# EAGLE design IO4-SignalDriver (EAGLE 7.7.0)
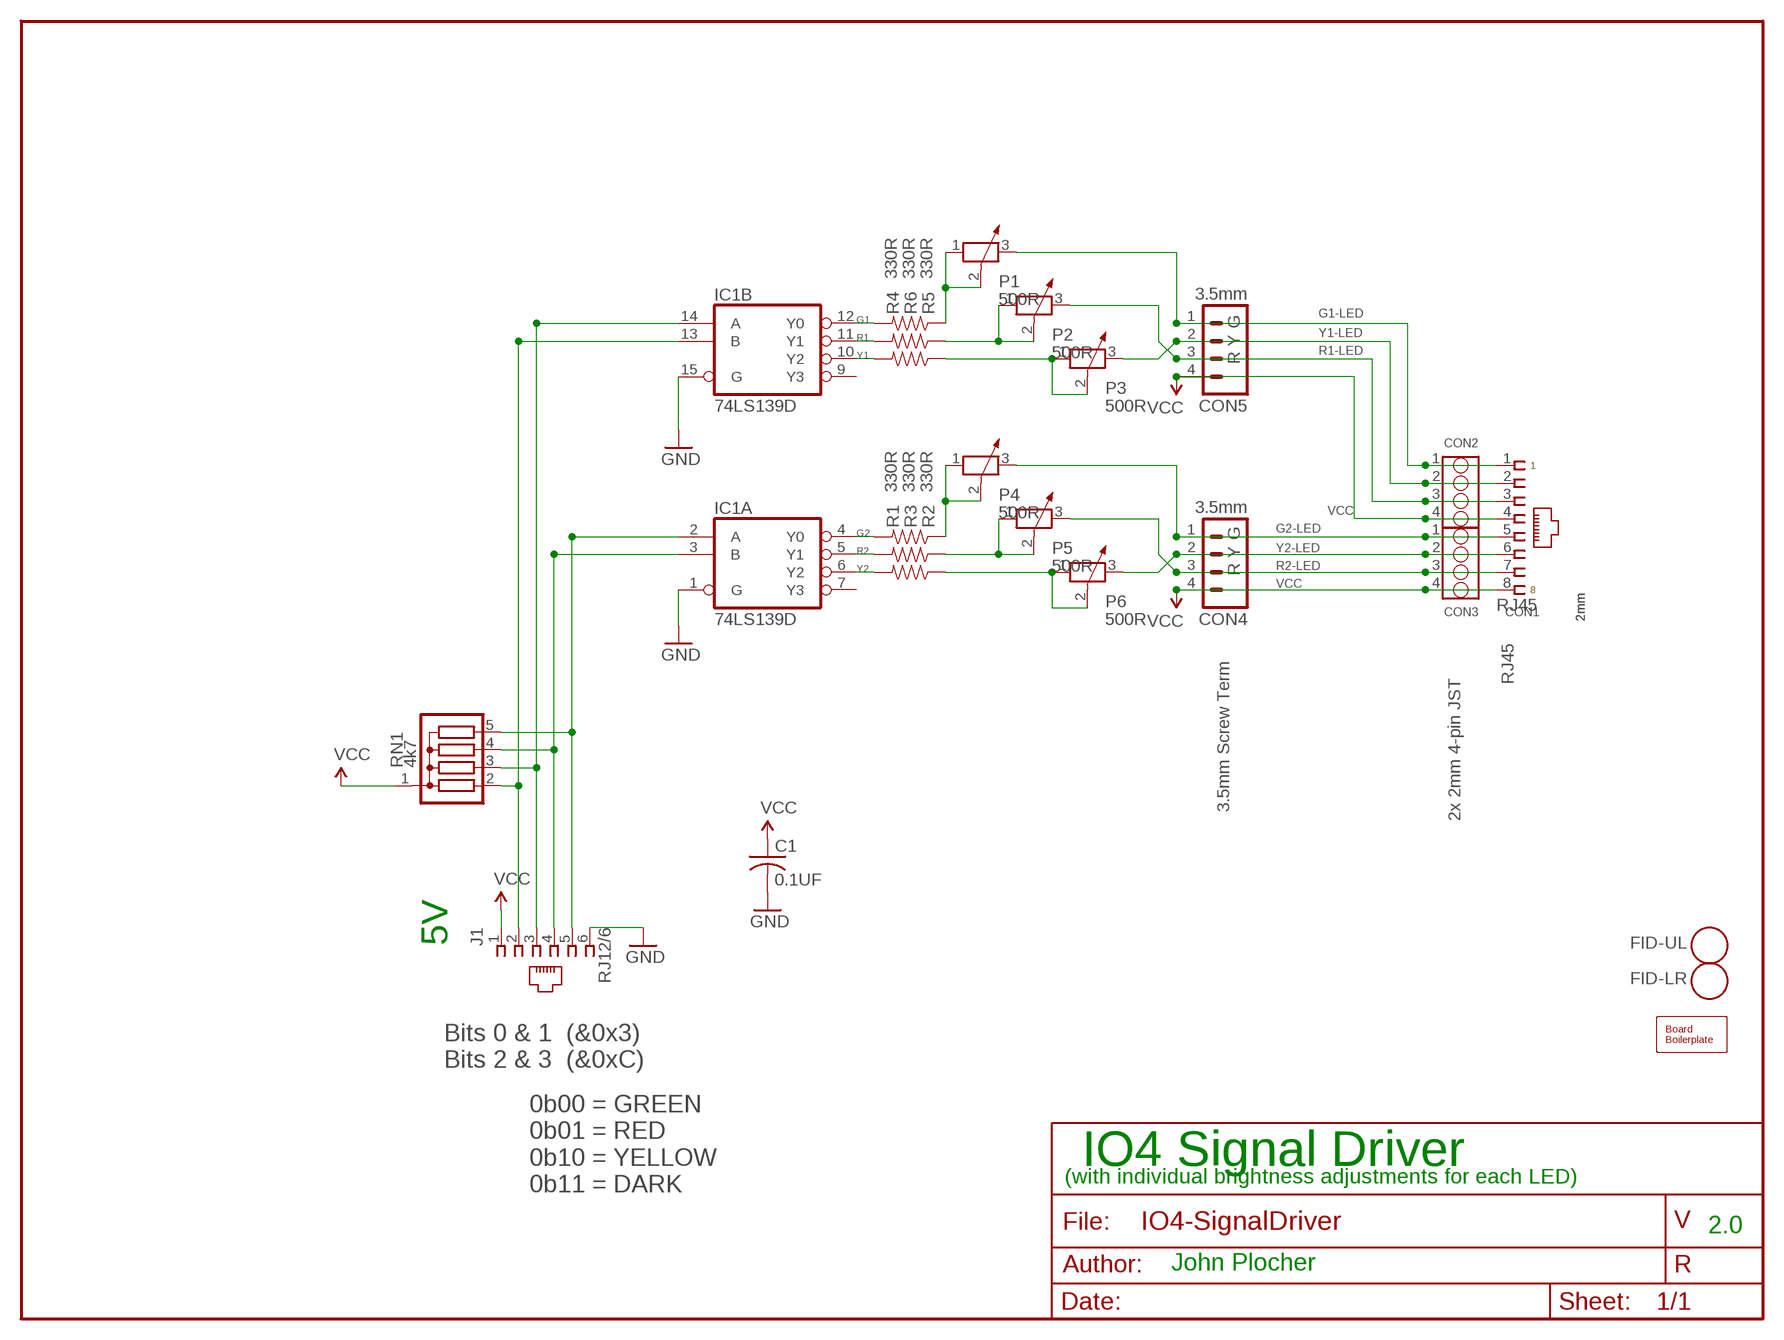
[diagram p0: schematic, sheet 1]

## Parts
BOARD1  BOARD  BOARD80X100  [BOARD-DINRAIL-3.17INX10CM]
C1  0.1UF  CAP0603  [0603-CAP]
CON1  RJ45  CONNECTOR-RJ45-FRONT  [RJ45-NO-SHIELD]
CON2  2mm  CONNECTOR-GROVE-4P-2.0-3470130P1  [4P-2.0]
CON3  2mm  CONNECTOR-GROVE-4P-2.0-3470130P1  [4P-2.0]
CON4  3.5mm  M04SCREW_LOCK  [SCREWTERMINAL-3.5MM-4_LOCK]
CON5  3.5mm  M04SCREW_LOCK  [SCREWTERMINAL-3.5MM-4_LOCK]
FID-LR  FIDUCIAL  [FIDUCIAL_1MM]
FID-UL  FIDUCIAL  [FIDUCIAL_1MM]
IC1  74LS139D  [SO16]
J1  RJ12/6  CONNECTOR-RJ25-6P6C  [RJ25-PANEL]
P1  500R  R-POTENTIOMETERP-3319  [P-3319]
P2  500R  R-POTENTIOMETERP-3319  [P-3319]
P3  500R  R-POTENTIOMETERP-3319  [P-3319]
P4  500R  R-POTENTIOMETERP-3319  [P-3319]
P5  500R  R-POTENTIOMETERP-3319  [P-3319]
P6  500R  R-POTENTIOMETERP-3319  [P-3319]
R1  330R  R0805-RES  [0805-RES]
R2  330R  R0805-RES  [0805-RES]
R3  330R  R0805-RES  [0805-RES]
R4  330R  R0805-RES  [0805-RES]
R5  330R  R0805-RES  [0805-RES]
R6  330R  R0805-RES  [0805-RES]
RN1  4k7  G04R  [SIL5]

## Nets
G1: IC1.12(B:Y0) R4.2
G1-LED: CON1.1 CON2.1 CON5.1 P1.3
G1V: P1.1 P1.2 R4.1
G2: IC1.4(A:Y0) R1.2
G2-LED: CON1.5 CON3.1 CON4.1 P4.3
G2V: P4.1 P4.2 R1.1
GND [power]: C1.2 IC1.1(A:G) IC1.15(B:G) J1.6
N$5: IC1.2(A:A) J1.5 RN1.5
N$6: IC1.3(A:B) J1.4 RN1.4
N$7: IC1.14(B:A) J1.3 RN1.3
N$8: IC1.13(B:B) J1.2 RN1.2
R1: IC1.11(B:Y1) R6.2
R1-LED: CON1.3 CON2.3 CON5.3 P2.3
R1V: P2.1 P2.2 R6.1
R2: IC1.5(A:Y1) R3.2
R2-LED: CON1.7 CON3.3 CON4.3 P5.3
R2V: P5.1 P5.2 R3.1
VCC [power]: C1.1 CON1.4 CON1.8 CON2.4 CON3.4 CON4.4 CON5.4 J1.1 RN1.1
Y1: IC1.10(B:Y2) R5.2
Y1-LED: CON1.2 CON2.2 CON5.2 P3.3
Y1V: P3.1 P3.2 R5.1
Y2: IC1.6(A:Y2) R2.2
Y2-LED: CON1.6 CON3.2 CON4.2 P6.3
Y2V: P6.1 P6.2 R2.1
Unconnected: IC1.7(A:Y3) IC1.9(B:Y3)

## Notes on the sheet
- G
- Y
- R
- G
- Y
- R
- RJ45
- 3.5mm Screw Term
- 2x 2mm 4-pin JST
- 5V
- Bits 0 & 1  (&0x3)
  Bits 2 & 3  (&0xC)
- IO4 Signal Driver
- (with individual brightness adjustments for each LED)
- 0b00 = GREEN
  0b01 = RED
  0b10 = YELLOW
  0b11 = DARK
- 2.0
- John Plocher

## Power pins joined to a net without a drawn wire
GND: IC1.8(P:GND)
VCC: IC1.16(P:VCC)

## Library data of the parts
BOARD1 = SPCoast:BOARD
C1 = SPCoast:CAP*
CON1 = SPCoast:CONNECTOR-RJ45: Tyco CORCOM Modular RJ Jacks No Shield; AMP: 520151-4; OPL: none
CON2 CON3 = SPCoast:CONNECTOR-GROVE-4P-2.0
CON4 CON5 = SparkFun:M04: Header 4 Standard 4-pin 0.1" header. Use with straight break away headers (SKU : PRT-00116), right angle break away headers (PRT-00553), swiss pins (PRT-00743), machine pins (PRT-00117), and female headers (PRT-00115). Molex polarized connector foot print use with SKU : PRT-08231 with associated crimp pins and housings. 1MM SMD Version SKU: PRT-10208
FID-LR FID-UL = SPCoast:FIDUCIAL: For use by pick and place machines to calibrate the vision/machine, 1mm By microbuilder.eu
IC1 = SPCoast:74*139: Dual 2-line to 4-line DECODER/DEMULTIPLEXER
J1 = SPCoast:CONNECTOR-RJ25: AMP connector; AMP: 520250-3; OPL: none
P1-P6 = SPCoast:R-POTENTIOMETER: Potentiometer
R1-R6 = SPCoast:R*: Resistor Basic schematic elements and footprints for 0603, 1206, and PTH 1/10th watt (small) resistors.
RN1 = resistor-sil:G04R: SIL RESISTOR; OC_FARNELL: unknown; OC_NEWARK: unknown

## Net classes
0 default: width 0.305 mm
1 power: width 0.406 mm

## Board
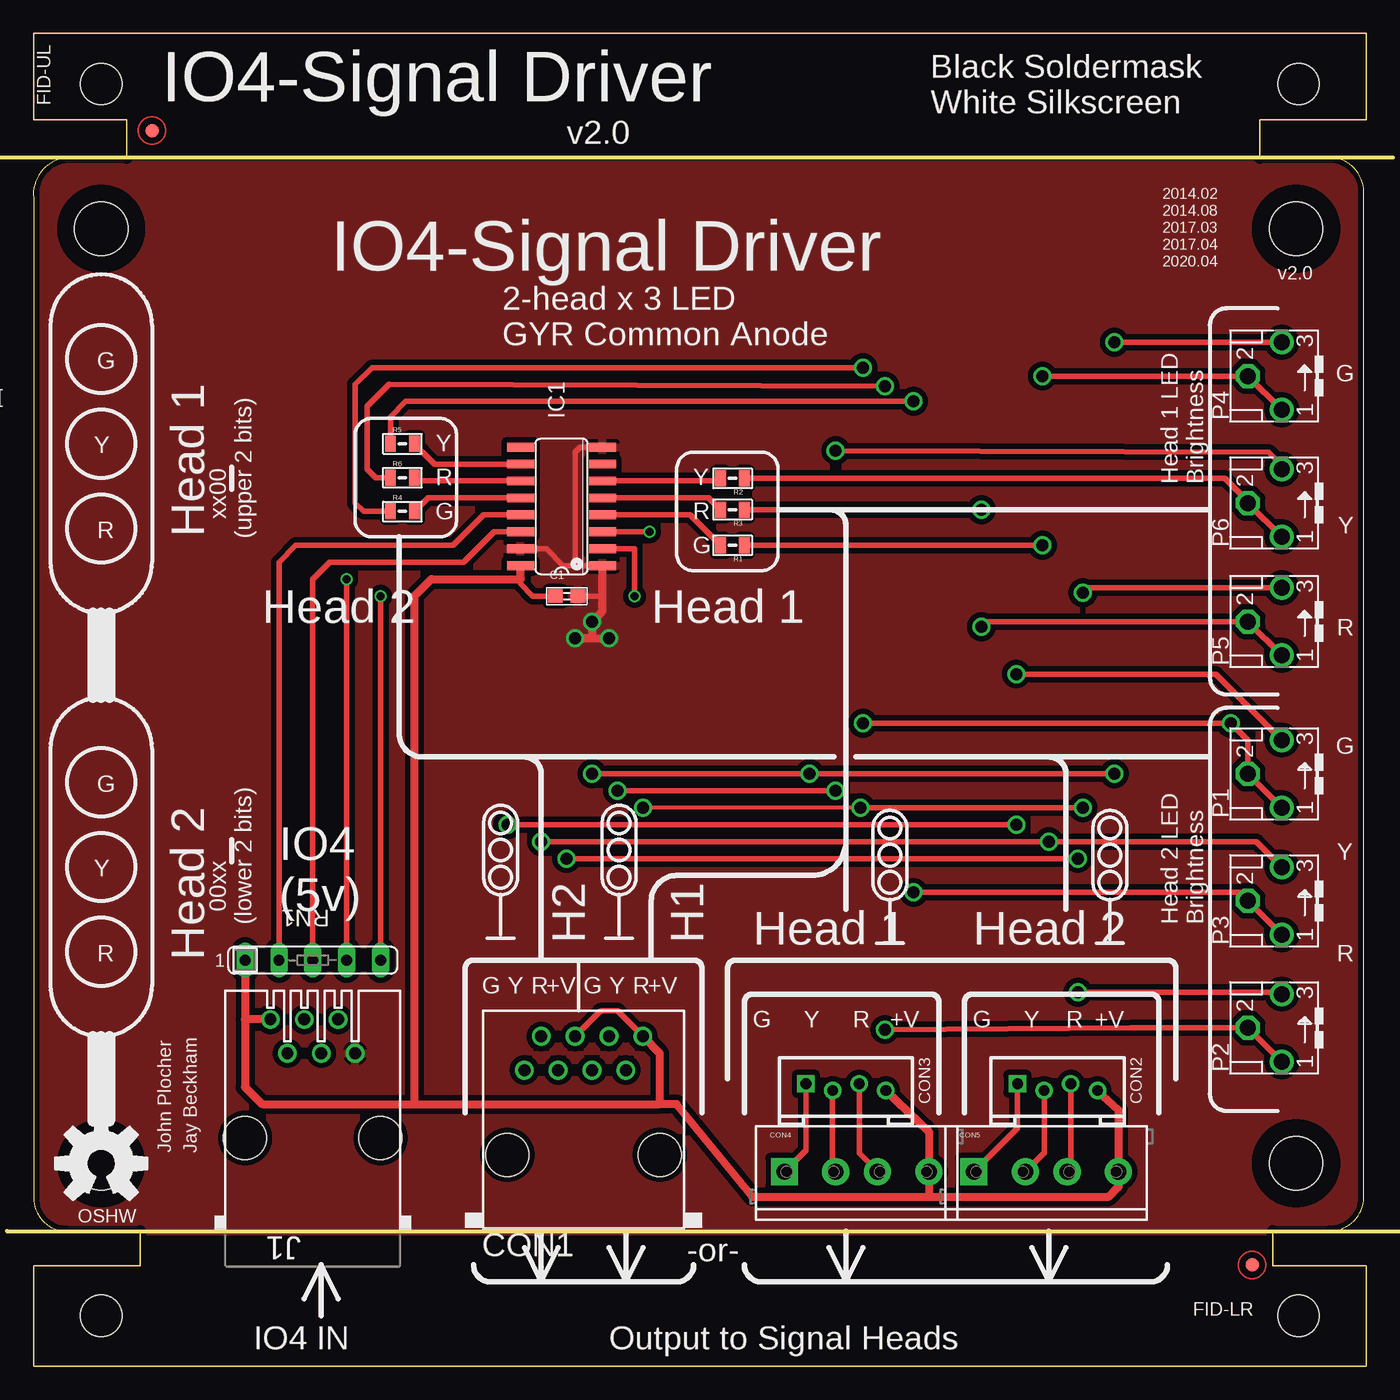
[diagram p1: board, top side]
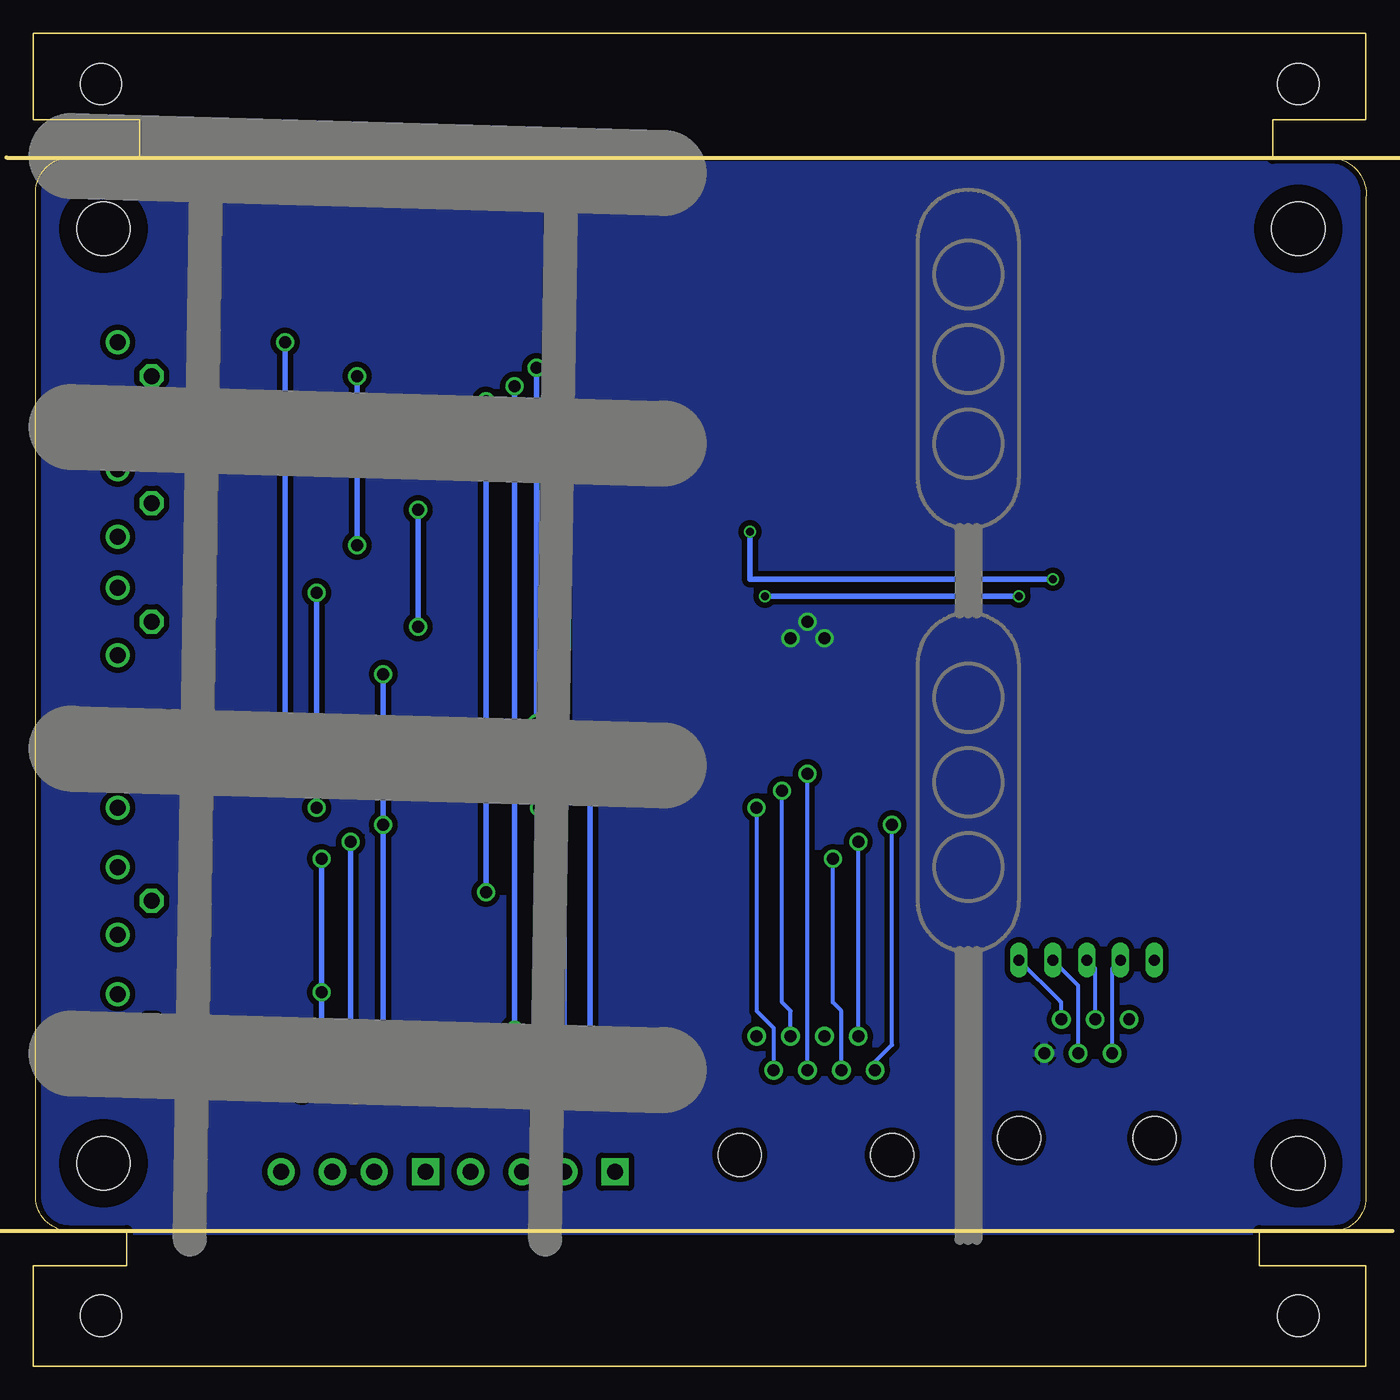
[diagram p2: board, bottom side, seen from below]

Size 100.01 x 100 mm. Coordinates in mm from the lower left corner, seen from the top.
Copper layers (1*16): Top 0.035mm / dielectric 1.5mm / Bottom 0.035mm
Design rules "Seeed_Fusion_eagle_rule_v1.1": minimum track width 6mil, minimum drill 12mil, track to track 6mil, track to pad 6mil, pad to pad 6mil, via to via 6mil, smd to smd 0mil, copper to edge 10mil, drill to drill 10mil, minimum pad ring 10mil, minimum via ring 6mil, stop-mask expansion 2mil, vias tented up to drill 100mil, thermal gap 10mil

### Footprints (pad centres in the part's own frame; a part is rotated, then mirrored left to right if it is on the bottom)
BOARD-DINRAIL-3.17INX10CM = hole 4: 94.742,15.24; 5.08,85.344; 94.742,85.344; 5.08,15.24 | hole 3.1: 5.08,96.19; 94.92,96.19; 5.08,3.81; 94.92,3.81
0603-CAP = smd 1.1 x 1: 1 -0.85,0; 2 0.85,0
RJ45-NO-SHIELD = drill 0.9 pad 1.4: 1 -4.445,6.35; 2 -3.175,8.89; 3 -1.905,6.35; 4 -0.635,8.89; 5 0.635,6.35; 6 1.905,8.89; 7 3.175,6.35; 8 4.445,8.89 | hole 3.251: -5.715,0; 5.715,0
4P-2.0 = drill 0.8 pad 1.27 square: 1 -3,0.254 | drill 0.8 pad 1.27: 2 -1,-0.254; 3 1,0.254; 4 3,-0.254
SCREWTERMINAL-3.5MM-4_LOCK = drill 1.2 pad 2.032 square: 1 -0.178,0 | drill 1.2 pad 2.032: 2 3.678,0; 3 6.822,0; 4 10.678,0
FIDUCIAL_1MM = smd 1 x 1: 1 0,0
SO16 = smd 0.66 x 2.032: 1 -4.445,-3.073; 2 -3.175,-3.073; 3 -1.905,-3.073; 4 -0.635,-3.073; 5 0.635,-3.073; 6 1.905,-3.073; 7 3.175,-3.073; 8 4.445,-3.073; 9 4.445,3.073; 10 3.175,3.073; 11 1.905,3.073; 12 0.635,3.073; 13 -0.635,3.073; 14 -1.905,3.073; 15 -3.175,3.073; 16 -4.445,3.073
RJ25-PANEL = drill 0.889: 1 -3.175,8.89; 2 -1.905,6.35; 3 -0.635,8.89; 4 0.635,6.35; 5 1.905,8.89; 6 3.175,6.35 | hole 3.251: -5.08,0; 5.08,0
P-3319 = drill 1.2: 1 -2.54,-0.318; 3 2.54,-0.318 | drill 1.2 octagon: 2 0,2.223
0805-RES = smd 0.8 x 1.2: 1 -0.9,0; 2 0.9,0
SIL5 = drill 0.813 long: 1 -5.08,0; 2 -2.54,0; 3 0,0; 4 2.54,0; 5 5.08,0

### Placement (x,y rotation side)
BOARD1  0.01,0 0 top
C1  40.02,57.78 0 top
CON1  41.29,15.88 0 top
CON2  76.85,20.95 0 top
CON3  60.97,20.95 0 top
CON4  56.53,14.61 0 top
CON5  70.75,14.61 0 top
FID-LR  91.45,7.62 0 top
FID-UL  8.9,92.71 0 top
IC1  39.64,64.52 90 top
J1  20.97,17.14 0 top
P1  93.36,44.45 90 top
P2  93.36,25.4 90 top
P3  93.36,34.92 90 top
P4  93.36,74.3 90 top
P5  93.36,55.88 90 top
P6  93.36,64.77 90 top
R1  52.46,61.59 180 top
R2  52.46,66.61 180 top
R3  52.46,64.26 180 top
R4  27.7,64.14 0 top
R5  27.7,69.22 0 top
R6  27.7,66.67 0 top
RN1  20.97,30.48 0 top
U$2  OSHW  [OSHW-LOGO-L]  5.09,15.24 0 top

### Tracks (layer width: path | path; a pad name or v marks a point on that pad's centre or on a via)
G1
  Top 0.406: IC1.12 29.62,65.15 R4.2
G1-LED  (via drill 0.9)
  Top 0.406: v35.57,40.64 v73.75,40.64 | CON5.1 73.85,17.88 CON2.1 | v73.75,51.94 88.72,51.94 P1.3
  Bottom 0.305: CON1.1 36.84,22.86 35.57,24.13 v35.57,40.64
  Bottom 0.406: CON2.1 73.75,21.18 v73.75,40.64 v73.75,51.94
G1V  (via drill 0.9)
  Top 0.406: R4.1 24.78,64.14 24.14,64.77 24.14,73.66 25.41,74.93 v62.24,74.93 | v62.24,48.26 v89.87,48.26 91.14,46.99 P1.2 P1.1
  Bottom 0.406: v62.24,48.26 v62.24,74.93
G2
  Top 0.406: IC1.4 49.28,63.88 R1.2
G2-LED  (via drill 0.9)
  Top 0.406: v41.92,44.45 v58.26,44.45 v81.12,44.45 | CON4.1 57.97,16.23 CON3.1 | v81.12,76.83 P4.3
  Bottom 0.305: CON1.5 v41.92,44.45
  Bottom 0.406: CON3.1 58.26,21.36 v58.26,44.45 | v81.12,44.45 v81.12,76.83
G2V  (via drill 0.9)
  Top 0.406: R1.1 v75.71,61.59 | v75.71,74.3 P4.2 P4.1
  Bottom 0.406: v75.71,61.59 v75.71,74.3
GND  (via drill 0.9)
  Top 0.406: C1.2 42.69,57.78 42.69,60.05 IC1.1 40.65,60.07 | IC1.15 38.49,61.34 39.76,60.07 40.65,60.07 | IC1.8 41.03,68.96 40.65,68.58 40.65,60.07
  Top 0.61: IC1.1 42.71,56.67 v41.92,55.88 41.92,54.61 v40.65,54.61 v43.19,54.61
  pour Bottom (isolate 0.406): 0.01,10.16 100.01,10.16 100.01,90.16 0.01,90.16
  pour Top (isolate 0.406): 0.01,10.16 100.01,10.16 100.01,90.16 0.01,90.16
N$5  (via drill 0.6)
  Top 0.406: RN1.5 v26.05,57.78 | v45.1,57.78 45.1,61.34 IC1.2
  Bottom 0.305: J1.5 22.87,27.2 arc-45 22.95,27.38 RN1.5
  Bottom 0.406: v26.05,57.78 v45.1,57.78
N$6  (via drill 0.6)
  Top 0.406: RN1.4 v23.51,59.05 | v46.24,62.61 IC1.3
  Bottom 0.305: J1.4 21.6,28.47 arc-45 21.68,28.65 RN1.4
  Bottom 0.406: v23.51,59.05 46.24,59.05 v46.24,62.61
N$7
  Top 0.406: RN1.3 20.97,59.05 22.24,60.33 32.27,60.33 34.56,62.61 IC1.14
  Bottom 0.305: J1.3 20.33,29.74 arc-45 20.41,29.92 RN1.3
N$8
  Top 0.406: RN1.2 18.43,60.33 19.7,61.59 31.51,61.59 33.8,63.88 IC1.13
  Bottom 0.305: J1.2 19.06,29.74 arc45 18.99,29.92 RN1.2
R1
  Top 0.406: IC1.11 28.85,66.42 R6.2
R1-LED  (via drill 0.9)
  Top 0.406: v40.02,38.1 v78.37,38.1 | CON5.3 77.85,14.88 CON2.3 | v78.37,28.07 93.55,28.07 P2.3
  Bottom 0.305: CON1.3 39.38,26.67 40.02,27.3 v40.02,38.1
  Bottom 0.406: CON2.3 78.37,21.61 v78.37,28.07 v78.37,38.1
R1V  (via drill 0.9)
  Top 0.406: R6.1 25.67,66.67 25.03,67.31 25.03,72.01 26.68,73.66 v63.89,73.53 | v63.89,25.27 82.37,25.4 P2.2 P2.1
  Bottom 0.406: v63.89,25.27 v63.89,73.53
R2
  Top 0.406: IC1.5 50.68,65.15 R3.2
R2-LED  (via drill 0.9)
  Top 0.305: v62.08,41.91 v45.73,41.91
  Top 0.406: CON4.3 61.97,15.98 CON3.3 | v62.08,41.91 v78.75,41.91 | v78.75,58.04 79.13,58.42 P5.3
  Bottom 0.305: v45.73,41.91 45.73,26.67 44.46,25.4 CON1.7
  Bottom 0.406: CON3.3 62.08,21.19 v62.08,41.91 | v78.75,58.04 v78.75,41.91
R2V  (via drill 0.9)
  Top 0.406: R3.1 v71.13,64.26 | v71.13,55.5 71.51,55.88 P5.2 P5.1
  Bottom 0.406: v71.13,64.26 v71.13,55.5
VCC
  Top 0.406: CON1.4 42.48,26.6 arc-45 42.66,26.67 43.83,26.67 CON1.8 | IC1.16 36.56,58.7 37.48,57.78 C1.1
  Top 0.61: CON1.8 47,23.5 47,19.68 | 67.32,12.7 80.66,12.7 81.36,13.4 arc45 81.43,13.58 CON5.4 81.43,19.25 CON2.4 | 67.32,12.7 54.09,12.7 arc-45 53.91,12.77 48.27,19.68 47,19.68 | 67.32,12.7 67.28,12.74 arc-45 67.21,12.92 CON4.4 67.21,17.59 CON3.4 | RN1.1 15.89,26.04 | 15.89,26.04 15.89,20.95 17.16,19.68 28.59,19.68 | 28.59,19.68 47,19.68 | 28.59,19.68 28.59,57.78 29.86,59.05 36.56,59.05 IC1.16 | J1.1 15.89,26.04
Y1
  Top 0.406: IC1.10 30.11,67.69 29.22,68.58 29.22,68.59 R5.2
Y1-LED  (via drill 0.9)
  Top 0.406: v38.11,39.37 v76.21,39.37 91.77,39.37 P3.3 | CON5.2 75.85,16.02 CON2.2
  Bottom 0.305: CON1.2 v38.11,39.37
  Bottom 0.406: CON2.2 76.21,21.19 v76.21,39.37
Y1V  (via drill 0.9)
  Top 0.406: R5.1 26.8,71.24 27.95,72.39 v66.05,72.39 | v66.05,35.56 90.5,35.56 P3.2 P3.1
  Bottom 0.406: v66.05,35.56 v66.05,72.39
Y2
  Top 0.406: IC1.6 51.37,66.42 R2.2
Y2-LED  (via drill 0.9)
  Top 0.406: v43.83,43.18 v60.21,43.18 | CON4.2 59.97,14.84 CON3.2 | v60.21,68.71 92.72,68.58 93.68,67.63 P6.3
  Bottom 0.305: CON1.6 43.19,26.67 43.83,27.3 v43.83,43.18
  Bottom 0.406: CON3.2 60.21,21.06 v60.21,43.18 v60.21,68.71
Y2V
  Top 0.406: R2.1 89.42,66.61 91.14,64.9 P6.2 P6.1

### Text on the board
tPlace: IO4-Signal Driver | Black Soldermask / White Silkscreen | v2.0 | 2014.02 | 2014.08 | 2017.03 | 2017.04 | IO4-Signal Driver | 2020.04 | v2.0 | 2-head x 3 LED / GYR Common Anode | G | G | ] | Y | Y | R | Y | Head 1 LED / Brightness | G | R | R | Head 1 | xx00 / (upper 2 bits) | Y | G | Head 2 | Head 1 | R | G | G | Y | Y | IO4 / (5v) | 00xx / (lower 2 bits) | Head 2 LED / Brightness | H2 | H1 | Head 1 | Head 2 | R | Head 2 | R | G | Y | R | +V | G | Y | R | +V | G | Y | R | +V | G | Y | R | +V | John Plocher | Jay Beckham | OSHW | -or- | IO4 IN | Output to Signal Heads
bDocu: Signal Driver | Model Railroading is fun! | www. SP Coast .com | Made in the PCR, Coast Division, NMRA | Go Bears! | Solder Side
Patch_Top: Changes: / Silk Screen alignment, tweeking / spaced fixed resistors further apart / min trace width 16mil / SMT components / 2mmx4 headers / SPCoast lbr update (Pots) / FIDs